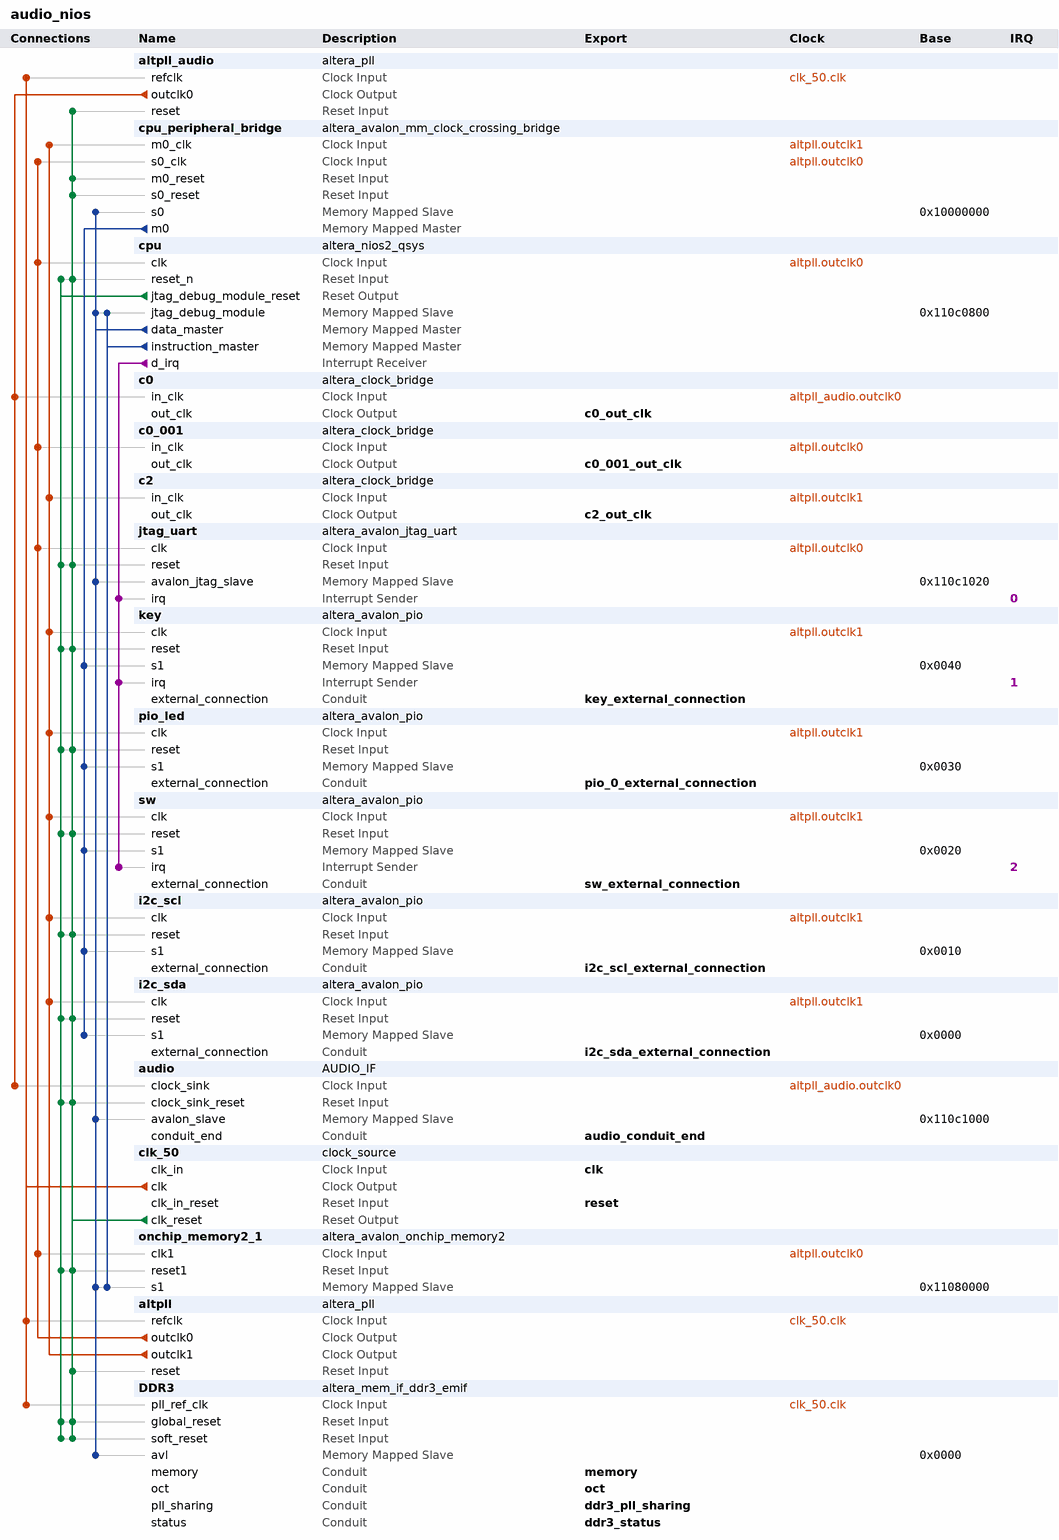
[diagram p0: system contents]
# Platform Designer (Qsys) system audio_nios, Cyclone V 5CSXFC6D6F31C8ES
# Parameters at their usual value, and those the tool derives, are not listed.
package require -exact qsys 13.0
create_system audio_nios
set_project_property DEVICE_FAMILY {Cyclone V}
set_project_property DEVICE 5CSXFC6D6F31C8ES

add_instance altpll_audio altera_pll 13.0
set_instance_parameter_value altpll_audio gui_device_speed_grade 2
set_instance_parameter_value altpll_audio gui_pll_mode {Fractional-N PLL}
set_instance_parameter_value altpll_audio gui_reference_clock_frequency 50.0
set_instance_parameter_value altpll_audio gui_operation_mode normal
set_instance_parameter_value altpll_audio gui_use_locked false
set_instance_parameter_value altpll_audio gui_number_of_clocks 1
set_instance_parameter_value altpll_audio gui_output_clock_frequency0 18.431999

add_instance cpu_peripheral_bridge altera_avalon_mm_clock_crossing_bridge 13.0
set_instance_parameter_value cpu_peripheral_bridge DATA_WIDTH 32
set_instance_parameter_value cpu_peripheral_bridge ADDRESS_WIDTH 9
set_instance_parameter_value cpu_peripheral_bridge MAX_BURST_SIZE 1
set_instance_parameter_value cpu_peripheral_bridge COMMAND_FIFO_DEPTH 32
set_instance_parameter_value cpu_peripheral_bridge RESPONSE_FIFO_DEPTH 64
set_instance_parameter_value cpu_peripheral_bridge MASTER_SYNC_DEPTH 3
set_instance_parameter_value cpu_peripheral_bridge SLAVE_SYNC_DEPTH 3

add_instance cpu altera_nios2_qsys 13.0
set_instance_parameter_value cpu resetSlave onchip_memory2_1.s1
set_instance_parameter_value cpu exceptionSlave onchip_memory2_1.s1
set_instance_parameter_value cpu breakSlave cpu.jtag_debug_module
set_instance_parameter_value cpu impl Fast
set_instance_parameter_value cpu icache_size 4096

add_instance c0 altera_clock_bridge 13.0
set_instance_parameter_value c0 DERIVED_CLOCK_RATE 18431999
set_instance_parameter_value c0 EXPLICIT_CLOCK_RATE 0

add_instance c0_001 altera_clock_bridge 13.0
set_instance_parameter_value c0_001 DERIVED_CLOCK_RATE 100000000
set_instance_parameter_value c0_001 EXPLICIT_CLOCK_RATE 0

add_instance c2 altera_clock_bridge 13.0
set_instance_parameter_value c2 DERIVED_CLOCK_RATE 10000000
set_instance_parameter_value c2 EXPLICIT_CLOCK_RATE 0

add_instance jtag_uart altera_avalon_jtag_uart 13.0.1
set_instance_parameter_value jtag_uart simInteractiveOptions INTERACTIVE_ASCII_OUTPUT

add_instance key altera_avalon_pio 13.0.1
set_instance_parameter_value key captureEdge true
set_instance_parameter_value key direction Input
set_instance_parameter_value key edgeType FALLING
set_instance_parameter_value key generateIRQ true
set_instance_parameter_value key irqType EDGE
set_instance_parameter_value key width 4

add_instance pio_led altera_avalon_pio 13.0.1
set_instance_parameter_value pio_led direction Output
set_instance_parameter_value pio_led width 4

add_instance sw altera_avalon_pio 13.0.1
set_instance_parameter_value sw captureEdge true
set_instance_parameter_value sw direction Input
set_instance_parameter_value sw edgeType FALLING
set_instance_parameter_value sw generateIRQ true
set_instance_parameter_value sw irqType EDGE
set_instance_parameter_value sw width 4

add_instance i2c_scl altera_avalon_pio 13.0.1
set_instance_parameter_value i2c_scl direction Output
set_instance_parameter_value i2c_scl width 1

add_instance i2c_sda altera_avalon_pio 13.0.1
set_instance_parameter_value i2c_sda direction Bidir
set_instance_parameter_value i2c_sda width 1

add_instance audio AUDIO_IF 1.0

add_instance clk_50 clock_source 13.0
set_instance_parameter_value clk_50 clockFrequency 50000000

add_instance onchip_memory2_1 altera_avalon_onchip_memory2 13.0.1
set_instance_parameter_value onchip_memory2_1 dataWidth 32
set_instance_parameter_value onchip_memory2_1 dualPort false
set_instance_parameter_value onchip_memory2_1 initMemContent true
set_instance_parameter_value onchip_memory2_1 initializationFileName onchip_memory2_1
set_instance_parameter_value onchip_memory2_1 memorySize 204800

add_instance altpll altera_pll 13.0
set_instance_parameter_value altpll gui_device_speed_grade 2
set_instance_parameter_value altpll gui_pll_mode {Integer-N PLL}
set_instance_parameter_value altpll gui_reference_clock_frequency 50.0
set_instance_parameter_value altpll gui_operation_mode normal
set_instance_parameter_value altpll gui_use_locked false
set_instance_parameter_value altpll gui_number_of_clocks 3
set_instance_parameter_value altpll gui_output_clock_frequency0 100.0
set_instance_parameter_value altpll gui_output_clock_frequency1 10.0
set_instance_parameter_value altpll gui_phase_shift_deg1 0
set_instance_parameter_value altpll gui_output_clock_frequency2 25.0

add_instance DDR3 altera_mem_if_ddr3_emif 13.0
set_instance_parameter_value DDR3 MEM_VENDOR JEDEC
set_instance_parameter_value DDR3 MEM_FORMAT DISCRETE
set_instance_parameter_value DDR3 MEM_CLK_FREQ_MAX 400.0
set_instance_parameter_value DDR3 MEM_ROW_ADDR_WIDTH 15
set_instance_parameter_value DDR3 MEM_COL_ADDR_WIDTH 8
set_instance_parameter_value DDR3 MEM_DQ_WIDTH 32
set_instance_parameter_value DDR3 MEM_BANKADDR_WIDTH 3
set_instance_parameter_value DDR3 MEM_WTCL 5
set_instance_parameter_value DDR3 MEM_TCL 6
set_instance_parameter_value DDR3 TIMING_TIS 200
set_instance_parameter_value DDR3 TIMING_TIH 275
set_instance_parameter_value DDR3 TIMING_TDS 75
set_instance_parameter_value DDR3 TIMING_TDH 150
set_instance_parameter_value DDR3 TIMING_TDQSQ 200
set_instance_parameter_value DDR3 TIMING_TDQSCK 400
set_instance_parameter_value DDR3 TIMING_TDQSS 0.25
set_instance_parameter_value DDR3 TIMING_TQSH 0.38
set_instance_parameter_value DDR3 TIMING_TDSH 0.2
set_instance_parameter_value DDR3 TIMING_TDSS 0.2
set_instance_parameter_value DDR3 MEM_TRAS_NS 37.5
set_instance_parameter_value DDR3 MEM_TRCD_NS 15.0
set_instance_parameter_value DDR3 MEM_TRP_NS 15.0
set_instance_parameter_value DDR3 MEM_TRFC_NS 300.0
set_instance_parameter_value DDR3 MEM_TWTR 4
set_instance_parameter_value DDR3 MEM_TFAW_NS 50.0
set_instance_parameter_value DDR3 MEM_TRRD_NS 13.2
set_instance_parameter_value DDR3 MEM_TRTP_NS 13.2
set_instance_parameter_value DDR3 RATE Half
set_instance_parameter_value DDR3 MEM_CLK_FREQ 300.0
set_instance_parameter_value DDR3 SPEED_GRADE 8
set_instance_parameter_value DDR3 HARD_EMIF false
set_instance_parameter_value DDR3 POWER_OF_TWO_BUS false
set_instance_parameter_value DDR3 AVL_MAX_SIZE 32
set_instance_parameter_value DDR3 PRIORITY_PORT 1,1,1,1,1,1
set_instance_parameter_value DDR3 CPORT_TYPE_PORT Bidirectional,Bidirectional,Bidirectional,Bidirectional,Bidirectional,Bidirectional
set_instance_parameter_value DDR3 REF_CLK_FREQ 50.0
set_instance_parameter_value DDR3 DEFAULT_FAST_SIM_MODEL true
set_instance_parameter_value DDR3 EXPORT_AFI_HALF_CLK false
set_instance_parameter_value DDR3 PLL_LOCATION Top_Bottom
set_instance_parameter_value DDR3 CALIBRATION_MODE Full
set_instance_parameter_value DDR3 USER_DEBUG_LEVEL 0
set_instance_parameter_value DDR3 TIMING_BOARD_MAX_CK_DELAY 0.03
set_instance_parameter_value DDR3 TIMING_BOARD_MAX_DQS_DELAY 0.03
set_instance_parameter_value DDR3 TIMING_BOARD_SKEW_CKDQS_DIMM_MIN 0.0
set_instance_parameter_value DDR3 TIMING_BOARD_SKEW_CKDQS_DIMM_MAX 0.0
set_instance_parameter_value DDR3 TIMING_BOARD_SKEW_WITHIN_DQS 0.01
set_instance_parameter_value DDR3 TIMING_BOARD_SKEW_BETWEEN_DQS 0.08
set_instance_parameter_value DDR3 TIMING_BOARD_DQ_TO_DQS_SKEW 0.0
set_instance_parameter_value DDR3 TIMING_BOARD_AC_SKEW 0.03
set_instance_parameter_value DDR3 TIMING_BOARD_AC_TO_CK_SKEW 0.0

# connections
add_connection altpll.outclk0 c0_001.in_clk clock
add_connection altpll.outclk0 cpu.clk clock
add_connection altpll.outclk0 cpu_peripheral_bridge.s0_clk clock
add_connection altpll.outclk0 jtag_uart.clk clock
add_connection altpll.outclk0 onchip_memory2_1.clk1 clock
add_connection altpll.outclk1 c2.in_clk clock
add_connection altpll.outclk1 cpu_peripheral_bridge.m0_clk clock
add_connection altpll.outclk1 i2c_scl.clk clock
add_connection altpll.outclk1 i2c_sda.clk clock
add_connection altpll.outclk1 key.clk clock
add_connection altpll.outclk1 pio_led.clk clock
add_connection altpll.outclk1 sw.clk clock
add_connection altpll_audio.outclk0 audio.clock_sink clock
add_connection altpll_audio.outclk0 c0.in_clk clock
add_connection clk_50.clk altpll.refclk clock
add_connection clk_50.clk altpll_audio.refclk clock
add_connection clk_50.clk DDR3.pll_ref_clk clock
add_connection clk_50.clk_reset altpll.reset reset
add_connection clk_50.clk_reset altpll_audio.reset reset
add_connection clk_50.clk_reset audio.clock_sink_reset reset
add_connection clk_50.clk_reset cpu.reset_n reset
add_connection clk_50.clk_reset cpu_peripheral_bridge.m0_reset reset
add_connection clk_50.clk_reset cpu_peripheral_bridge.s0_reset reset
add_connection clk_50.clk_reset DDR3.global_reset reset
add_connection clk_50.clk_reset DDR3.soft_reset reset
add_connection clk_50.clk_reset i2c_scl.reset reset
add_connection clk_50.clk_reset i2c_sda.reset reset
add_connection clk_50.clk_reset jtag_uart.reset reset
add_connection clk_50.clk_reset key.reset reset
add_connection clk_50.clk_reset onchip_memory2_1.reset1 reset
add_connection clk_50.clk_reset pio_led.reset reset
add_connection clk_50.clk_reset sw.reset reset
add_connection cpu.jtag_debug_module_reset audio.clock_sink_reset reset
add_connection cpu.jtag_debug_module_reset cpu.reset_n reset
add_connection cpu.jtag_debug_module_reset DDR3.global_reset reset
add_connection cpu.jtag_debug_module_reset DDR3.soft_reset reset
add_connection cpu.jtag_debug_module_reset i2c_scl.reset reset
add_connection cpu.jtag_debug_module_reset i2c_sda.reset reset
add_connection cpu.jtag_debug_module_reset jtag_uart.reset reset
add_connection cpu.jtag_debug_module_reset key.reset reset
add_connection cpu.jtag_debug_module_reset onchip_memory2_1.reset1 reset
add_connection cpu.jtag_debug_module_reset pio_led.reset reset
add_connection cpu.jtag_debug_module_reset sw.reset reset
add_connection cpu.data_master audio.avalon_slave avalon
set_connection_parameter_value cpu.data_master/audio.avalon_slave baseAddress 0x110c1000
add_connection cpu.data_master cpu.jtag_debug_module avalon
set_connection_parameter_value cpu.data_master/cpu.jtag_debug_module baseAddress 0x110c0800
add_connection cpu.data_master cpu_peripheral_bridge.s0 avalon
set_connection_parameter_value cpu.data_master/cpu_peripheral_bridge.s0 baseAddress 0x10000000
add_connection cpu.data_master DDR3.avl avalon
set_connection_parameter_value cpu.data_master/DDR3.avl baseAddress 0x0000
add_connection cpu.data_master jtag_uart.avalon_jtag_slave avalon
set_connection_parameter_value cpu.data_master/jtag_uart.avalon_jtag_slave baseAddress 0x110c1020
add_connection cpu.data_master onchip_memory2_1.s1 avalon
set_connection_parameter_value cpu.data_master/onchip_memory2_1.s1 baseAddress 0x11080000
add_connection cpu.instruction_master cpu.jtag_debug_module avalon
set_connection_parameter_value cpu.instruction_master/cpu.jtag_debug_module baseAddress 0x110c0800
add_connection cpu.instruction_master onchip_memory2_1.s1 avalon
set_connection_parameter_value cpu.instruction_master/onchip_memory2_1.s1 baseAddress 0x11080000
add_connection cpu_peripheral_bridge.m0 i2c_scl.s1 avalon
set_connection_parameter_value cpu_peripheral_bridge.m0/i2c_scl.s1 baseAddress 0x0010
add_connection cpu_peripheral_bridge.m0 i2c_sda.s1 avalon
set_connection_parameter_value cpu_peripheral_bridge.m0/i2c_sda.s1 baseAddress 0x0000
add_connection cpu_peripheral_bridge.m0 key.s1 avalon
set_connection_parameter_value cpu_peripheral_bridge.m0/key.s1 baseAddress 0x0040
add_connection cpu_peripheral_bridge.m0 pio_led.s1 avalon
set_connection_parameter_value cpu_peripheral_bridge.m0/pio_led.s1 baseAddress 0x0030
add_connection cpu_peripheral_bridge.m0 sw.s1 avalon
set_connection_parameter_value cpu_peripheral_bridge.m0/sw.s1 baseAddress 0x0020
add_connection cpu.d_irq jtag_uart.irq interrupt
set_connection_parameter_value cpu.d_irq/jtag_uart.irq irqNumber 0
add_connection cpu.d_irq key.irq interrupt
set_connection_parameter_value cpu.d_irq/key.irq irqNumber 1
add_connection cpu.d_irq sw.irq interrupt
set_connection_parameter_value cpu.d_irq/sw.irq irqNumber 2

# exported interfaces
add_interface c0_out_clk clock source
set_interface_property c0_out_clk EXPORT_OF c0.out_clk
add_interface c0_001_out_clk clock source
set_interface_property c0_001_out_clk EXPORT_OF c0_001.out_clk
add_interface key_external_connection conduit end
set_interface_property key_external_connection EXPORT_OF key.external_connection
add_interface pio_0_external_connection conduit end
set_interface_property pio_0_external_connection EXPORT_OF pio_led.external_connection
add_interface sw_external_connection conduit end
set_interface_property sw_external_connection EXPORT_OF sw.external_connection
add_interface i2c_scl_external_connection conduit end
set_interface_property i2c_scl_external_connection EXPORT_OF i2c_scl.external_connection
add_interface i2c_sda_external_connection conduit end
set_interface_property i2c_sda_external_connection EXPORT_OF i2c_sda.external_connection
add_interface audio_conduit_end conduit end
set_interface_property audio_conduit_end EXPORT_OF audio.conduit_end
add_interface clk clock sink
set_interface_property clk EXPORT_OF clk_50.clk_in
add_interface reset reset sink
set_interface_property reset EXPORT_OF clk_50.clk_in_reset
add_interface c2_out_clk clock source
set_interface_property c2_out_clk EXPORT_OF c2.out_clk
add_interface memory conduit end
set_interface_property memory EXPORT_OF DDR3.memory
add_interface oct conduit end
set_interface_property oct EXPORT_OF DDR3.oct
add_interface ddr3_pll_sharing conduit end
set_interface_property ddr3_pll_sharing EXPORT_OF DDR3.pll_sharing
add_interface ddr3_status conduit end
set_interface_property ddr3_status EXPORT_OF DDR3.status

set_interconnect_requirement {$system} qsys_mm.clockCrossingAdapter HANDSHAKE
set_interconnect_requirement {$system} qsys_mm.maxAdditionalLatency 0

save_system audio_nios.qsys
